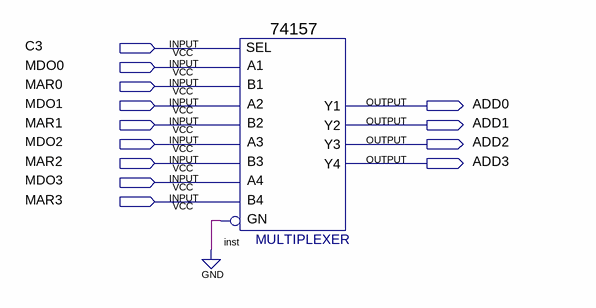
[diagram p0: schematic sheet]
// Quartus schematic AddrSelector.bdf as structural Verilog: 1 symbols, 13 pins
module AddrSelector (
  input  C3,
  input  MDO0,
  input  MAR0,
  input  MDO1,
  input  MAR1,
  input  MDO2,
  input  MAR2,
  input  MDO3,
  input  MAR3,
  output ADD0,
  output ADD1,
  output ADD2,
  output ADD3
);

  \74157  inst (
    .A1(MDO0), .B1(MAR0), .SEL(C3), .B2(MAR1), .A3(MDO2), .B3(MAR2), .A2(MDO1), .B4(MAR3), .GN(1'b0),
    .A4(MDO3), .Y2(ADD1), .Y1(ADD0), .Y4(ADD3), .Y3(ADD2));
endmodule
